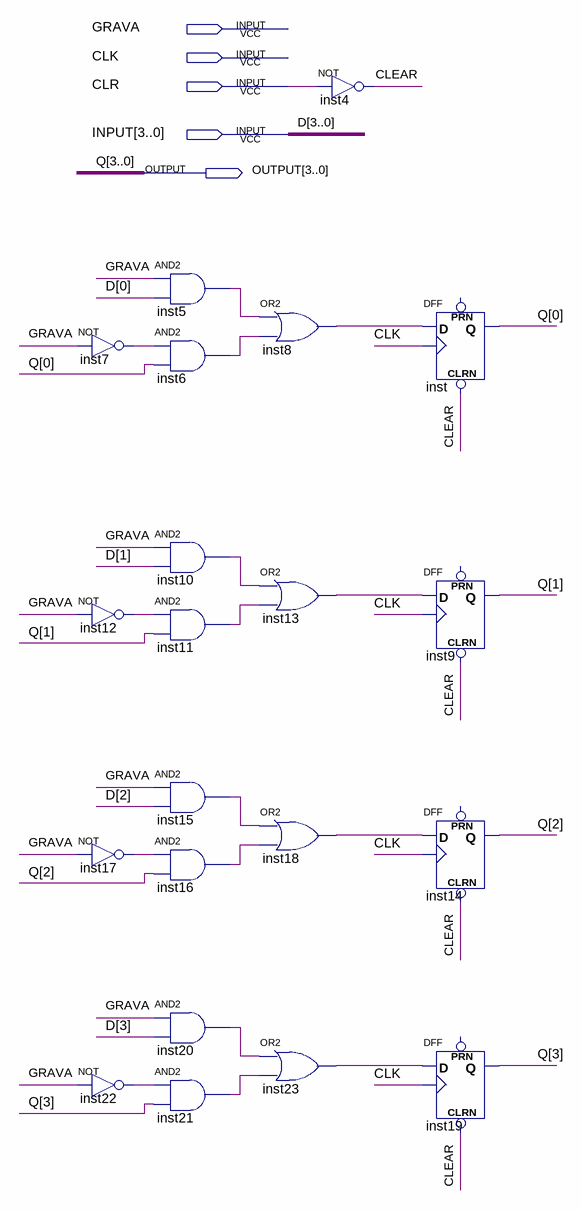
[diagram p0: schematic sheet]
// Quartus schematic Reg4Bits.bdf as structural Verilog: 21 symbols, 5 pins
module Reg4Bits (
  input  GRAVA,
  input  CLK,
  input  CLR,
  input  [3:0] INPUT,
  output [3:0] OUTPUT
);

  wire CLEAR, inst5_out, inst6_out, inst7_out, inst8_out, inst10_out, inst11_out, inst12_out, inst13_out,
       inst15_out, inst16_out, inst17_out, inst18_out, inst20_out, inst21_out, inst22_out, inst23_out;

  not inst7 (inst7_out, GRAVA);
  not inst12 (inst12_out, GRAVA);
  not inst17 (inst17_out, GRAVA);
  not inst22 (inst22_out, GRAVA);
  and inst5 (inst5_out, GRAVA, INPUT[0]);
  and inst6 (inst6_out, inst7_out, OUTPUT[0]);
  and inst10 (inst10_out, GRAVA, INPUT[1]);
  and inst11 (inst11_out, inst12_out, OUTPUT[1]);
  and inst15 (inst15_out, GRAVA, INPUT[2]);
  and inst16 (inst16_out, inst17_out, OUTPUT[2]);
  and inst20 (inst20_out, GRAVA, INPUT[3]);
  and inst21 (inst21_out, inst22_out, OUTPUT[3]);
  not inst4 (CLEAR, CLR);
  or inst8 (inst8_out, inst5_out, inst6_out);
  or inst13 (inst13_out, inst10_out, inst11_out);
  or inst18 (inst18_out, inst15_out, inst16_out);
  or inst23 (inst23_out, inst20_out, inst21_out);
  DFF inst (.CLRN(CLEAR), .CLK(CLK), .D(inst8_out), .Q(OUTPUT[0]));  // open: PRN
  DFF inst9 (.CLRN(CLEAR), .CLK(CLK), .D(inst13_out), .Q(OUTPUT[1]));  // open: PRN
  DFF inst14 (.CLRN(CLEAR), .CLK(CLK), .D(inst18_out), .Q(OUTPUT[2]));  // open: PRN
  DFF inst19 (.CLRN(CLEAR), .CLK(CLK), .D(inst23_out), .Q(OUTPUT[3]));  // open: PRN

  // Other names for the same wires on the sheet: D[3:0] = INPUT; Q[3:0] = OUTPUT
endmodule
